# Altium schematic sheet LED & Button.SchDoc
size A
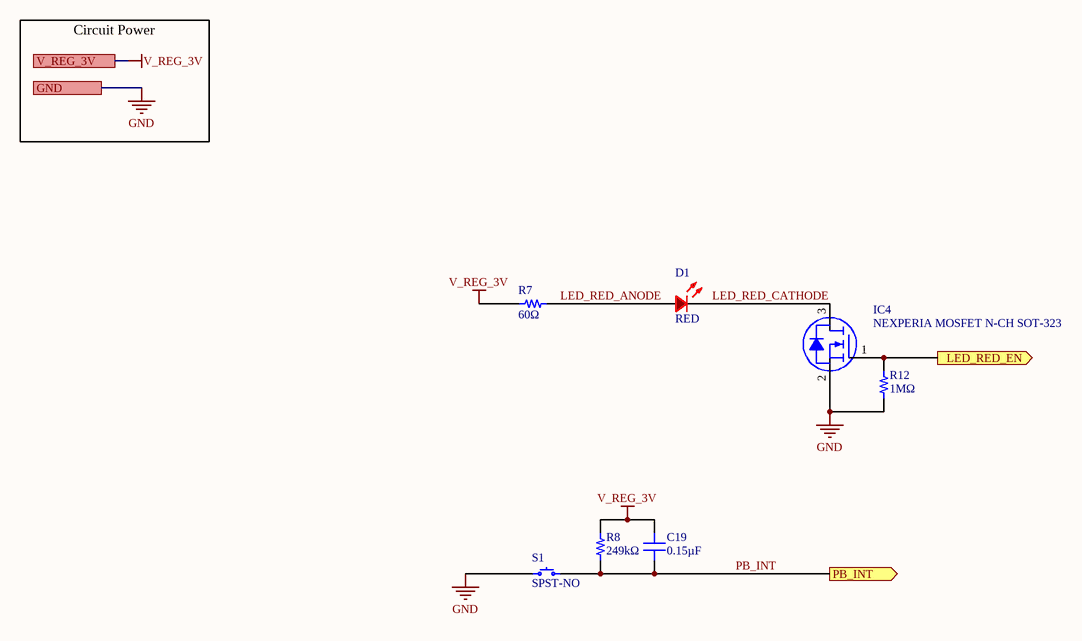
[diagram p0: LED & Button.SchDoc]

## Parts
C19  0.15µF  [CAP 0603_1608]
D1  RED  [LED 0603_1608]
IC4  NEXPERIA MOSFET N-CH SOT-323  [NEXPERIA SOT-323]
R7  60Ω  [RES 0603_1608 RF]
R8  249kΩ  [RES 0603_1608 RF]
R12  1MΩ  [RES 0603_1608 RF]
S1  SPST-NO  [PANASONIC EVP-AA002K]

## Ports
GND, LED_RED_EN (out), PB_INT (out), V_REG_3V

## Nets
GND: IC4.2(S) R12.1 S1.1 ; port GND
V_REG_3V: C19.2 R7.1 R8.2 ; port V_REG_3V
LED_RED_ANODE: D1.1 R7.2
LED_RED_CATHODE: D1.2 IC4.3(D)
LED_RED_EN: IC4.1(G) R12.2 ; port LED_RED_EN
PB_INT: C19.1 R8.1 S1.2 ; port PB_INT

## Notes on the sheet
- Circuit Power

## Library data of the parts
C19 = CAP00008: CAP CER 0.15UF 10V X7R 0603; Manufacturer: KEMET; Manufacturer P/N: C0603C154K8RACTU; Tolerance: ±10%; Device ID: CAP00008; Mounting Type: Surface Mount; Part Type: Capacitor; VALUE: 0.15µF; Operating Temperature: -55°C ~ 125°C; Voltage: 10V; Package: 0603 (1608 Metric); Supplier1: Digi-Key; Supplier1 P/N: 399-7862-1-ND; Supplier2: Mouser; Supplier2 P/N: 80-C0603C154K8R; Temperature Coefficient: X7R
D1 = LED0000A: LED RED CLEAR 0603 SMD; Manufacturer: Würth Elektronik; Manufacturer P/N: 150060RS75000; If - Forward Current: 100mA; Vf - Forward Voltage: 2.0V; Wavelength: 625nm; Viewing Angle: 140°; Lens Color: Colorless; Device ID: LED0000A; VALUE: RED; Mounting Type: Surface Mount; Part Type: LED; Operating Temperature: -40°C ~ 85°C; Package: 0603 (1608 Metric); Color: Red; Supplier1: Digi-Key; Supplier1 P/N: 732-4978-1-ND
IC4 = MOS00000: MOSFET N-CH 60V 320MA SOT323; Manufacturer: Nexperia USA Inc.; Manufacturer P/N: BSS138PW,115; FET Type: N-Channel; VALUE: NFET; Current - Continuous Drain (Id) @ 25°C: 320mA (Ta); Drive Voltage (Max Rds On, Min Rds On): 10V; Rds On (Max) @ Id, Vgs: 1.6Ohm @ 300mA, 10V; Vgs(th) (Max) @ Id: 1.5V @ 250µA; Vgs (Max): ±20V; Power Dissipation (Max): 260mW (Ta), 830mW (Tc); Gate Charge (Qg) (Max) @ Vgs: 0.8 nC @ 4.5 V; Input Capacitance (Ciss) (Max) @ Vds: 50 pF @ 10 V; Device ID: MOS00000; Package: SOT-323; Part Type: IC; Technology: MOSFET (Metal Oxide); FET Feature: -; Operating Temperature: -55°C ~ 150°C (TA); Mounting Type: Surface Mount; Drain to Source Voltage (Vdss): 60V; Supplier1: Digi-Key; Supplier1 P/N: 1727-1143-1-ND; Supplier2: Mouser; Supplier2 P/N: 771-BSS138PW115
R7 = RES00034: RES 60 OHM 1% 1/10W 0603; Manufacturer: Vishay Dale; Manufacturer P/N: ‎CRCW0603820KFKEAC‎; Power: 0.100W; Device ID: RES00034; VALUE: 60Ω; Mounting Type: Surface Mount; Part Type: Resistor; Operating Temperature: -55°C ~ 155°C; Package: 0603 (1608 Metric); Tolerance: ±1%; Composition: Thick Film; Supplier1: Digi-Key; Supplier1 P/N: ‎541-5568-1-ND‎; Supplier2: Mouser; Supplier2 P/N: 71-CRCW0603820KFKEAC
R8 = RES0000A: RES SMD 249K OHM 0.1% 1/10W 0603; Manufacturer: Susumu; Manufacturer P/N: RG1608P-2493-B-T5; Power: 0.100W; Device ID: RES0000A; VALUE: 249kΩ; Mounting Type: Surface Mount; Part Type: Resistor; Operating Temperature: -55°C ~ 155°C; Package: 0603 (1608 Metric); Tolerance: ±0.1%; Composition: Thin Film; Supplier1: Digi-Key; Supplier1 P/N: RG16P249KBCT-ND; Supplier2: Mouser; Supplier2 P/N: 754-RG1608P-2493-BT5
R12 = RES0003E: RES 1M OHM 1% 1/10W 0603; Manufacturer: Vishay Dale; Manufacturer P/N: ‎CRCW0603820KFKEAC‎; Power: 0.100W; Device ID: RES0003E; VALUE: 1MΩ; Mounting Type: Surface Mount; Part Type: Resistor; Operating Temperature: -55°C ~ 155°C; Package: 0603 (1608 Metric); Tolerance: ±1%; Composition: Thick Film; Supplier1: Digi-Key; Supplier1 P/N: ‎541-5568-1-ND‎; Supplier2: Mouser; Supplier2 P/N: 71-CRCW0603820KFKEAC
S1 = BUT00002: SWITCH TACTILE SPST-NO 0.02A 15V; Manufacturer: Panasonic Electronic Components; Manufacturer P/N: EVP-AA002K; Switch Function: Off-Mom; Contact Rating @ Voltage: 0.02A @ 15VDC; Operating Force: 100gf; Device ID: BUT00002; Part Type: Button; VALUE: SPST-NO; Operating Temperature: -40°C ~ 85°C; Package: 4-Lead SMT; Supplier1: Digi-Key; Supplier1 P/N: P13347SCT-ND; Supplier2: Mouser; Supplier2 P/N: 667-EVP-AA002K; Mounting Type: Surface Mount